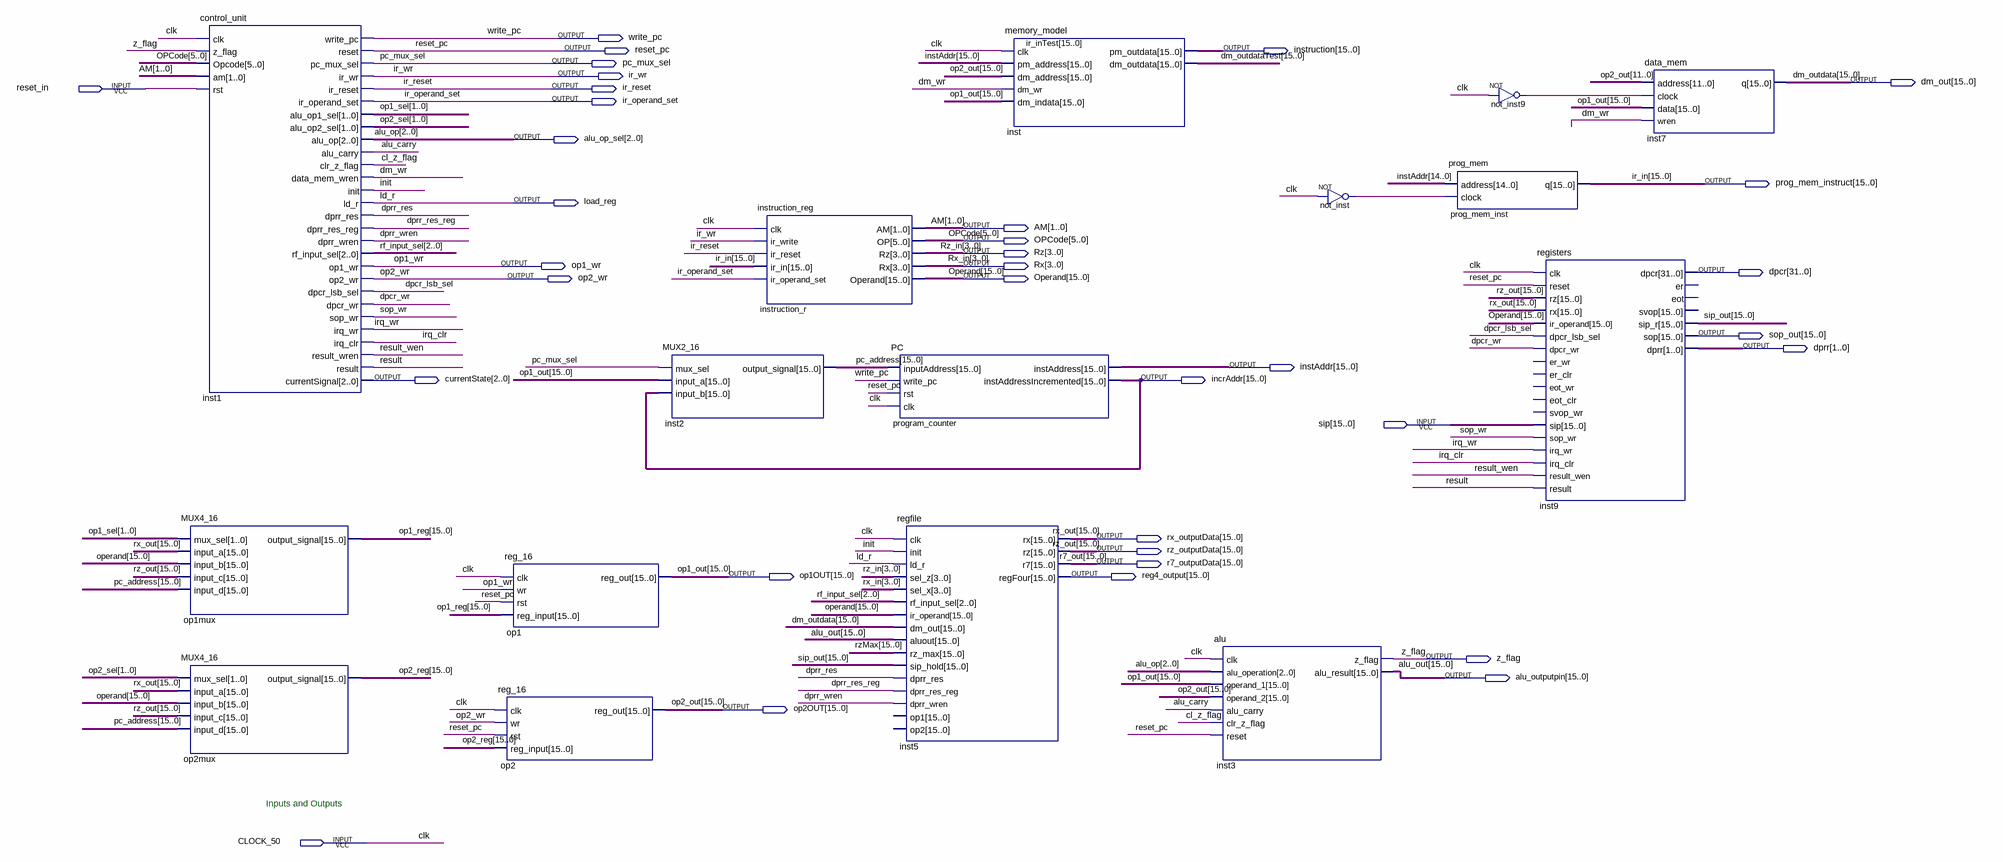
[diagram p0: schematic sheet]
// Quartus schematic pc_test.bdf as structural Verilog: 16 symbols, 35 pins
module pc_test (
  input  reset_in,
  input  [15:0] sip,
  input  CLOCK_50,
  output write_pc,
  output reset_pc,
  output [15:0] instruction,
  output pc_mux_sel,
  output ir_wr,
  output [15:0] dm_out,
  output ir_reset,
  output ir_operand_set,
  output [2:0] alu_op_sel,
  output [15:0] prog_mem_instruct,
  output load_reg,
  output [1:0] AM,
  output [5:0] OPCode,
  output [3:0] Rz,
  output op1_wr,
  output [3:0] Rx,
  output [31:0] dpcr,
  output op2_wr,
  output [15:0] Operand,
  output [15:0] sop_out,
  output [1:0] dprr,
  output [15:0] instAddr,
  output [2:0] currentState,
  output [15:0] incrAddr,
  output [15:0] rx_outputData,
  output [15:0] rz_outputData,
  output [15:0] r7_outputData,
  output [15:0] op1OUT,
  output [15:0] reg4_output,
  output z_flag,
  output [15:0] alu_outputpin,
  output [15:0] op2OUT
);

  wire alu_carry, cl_z_flag, dm_wr, dpcr_lsb_sel, dpcr_wr, dprr_res, dprr_res_reg, dprr_wren, init, irq_clr,
       irq_wr, not_inst9_out, not_inst_out, result, result_wen, sop_wr;
  wire [1:0] op1_sel, op2_sel;
  wire [2:0] rf_input_sel;
  wire [15:0] dm_outdataTest, op1_reg, op2_reg, pc_address, rzMax, sip_out;

  MUX4_16 op1mux (
    .mux_sel(op1_sel), .input_a(rx_outputData), .input_b(Operand), .input_c(rz_outputData),
    .input_d(pc_address), .output_signal(op1_reg));
  MUX4_16 op2mux (
    .mux_sel(op2_sel), .input_a(rx_outputData), .input_b(Operand), .input_c(rz_outputData),
    .input_d(pc_address), .output_signal(op2_reg));
  control_unit inst1 (
    .clk(CLOCK_50), .z_flag(z_flag), .Opcode(OPCode), .am(AM), .rst(reset_in), .write_pc(write_pc),
    .reset(reset_pc), .pc_mux_sel(pc_mux_sel), .ir_wr(ir_wr), .ir_reset(ir_reset),
    .ir_operand_set(ir_operand_set), .alu_op1_sel(op1_sel), .alu_op2_sel(op2_sel), .alu_op(alu_op_sel),
    .alu_carry(alu_carry), .clr_z_flag(cl_z_flag), .data_mem_wren(dm_wr), .init(init), .ld_r(load_reg),
    .dprr_res(dprr_res), .dprr_res_reg(dprr_res_reg), .dprr_wren(dprr_wren), .rf_input_sel(rf_input_sel),
    .op1_wr(op1_wr), .op2_wr(op2_wr), .dpcr_lsb_sel(dpcr_lsb_sel), .dpcr_wr(dpcr_wr), .sop_wr(sop_wr),
    .irq_wr(irq_wr), .irq_clr(irq_clr), .result_wren(result_wen), .result(result),
    .currentSignal(currentState));
  reg_16 op1 (.clk(CLOCK_50), .wr(op1_wr), .rst(reset_pc), .reg_input(op1_reg), .reg_out(op1OUT));
  reg_16 op2 (.clk(CLOCK_50), .wr(op2_wr), .rst(reset_pc), .reg_input(op2_reg), .reg_out(op2OUT));
  MUX2_16 inst2 (.mux_sel(pc_mux_sel), .input_a(op1OUT), .input_b(incrAddr), .output_signal(pc_address));
  instruction_reg instruction_r (
    .clk(CLOCK_50), .ir_write(ir_wr), .ir_reset(ir_reset), .ir_in(prog_mem_instruct),
    .ir_operand_set(ir_operand_set), .AM(AM), .OP(OPCode), .Rz(Rz), .Rx(Rx), .Operand(Operand));
  PC program_counter (
    .inputAddress(pc_address), .write_pc(write_pc), .rst(reset_pc), .clk(CLOCK_50), .instAddress(instAddr),
    .instAddressIncremented(incrAddr));
  regfile inst5 (
    .clk(CLOCK_50), .init(init), .ld_r(load_reg), .sel_z(Rz), .sel_x(Rx), .rf_input_sel(rf_input_sel),
    .ir_operand(Operand), .dm_out(dm_out), .aluout(alu_outputpin), .rz_max(rzMax), .sip_hold(sip_out),
    .dprr_res(dprr_res), .dprr_res_reg(dprr_res_reg), .dprr_wren(dprr_wren), .rx(rx_outputData),
    .rz(rz_outputData), .r7(r7_outputData), .regFour(reg4_output));  // open: op1, op2
  memory_model inst (
    .clk(CLOCK_50), .pm_address(instAddr), .dm_address(op2OUT), .dm_wr(dm_wr), .dm_indata(op1OUT),
    .pm_outdata(instruction), .dm_outdata(dm_outdataTest));
  alu inst3 (
    .clk(CLOCK_50), .alu_operation(alu_op_sel), .operand_1(op1OUT), .operand_2(op2OUT),
    .alu_carry(alu_carry), .clr_z_flag(cl_z_flag), .reset(reset_pc), .z_flag(z_flag),
    .alu_result(alu_outputpin));
  not not_inst (not_inst_out, CLOCK_50);
  prog_mem prog_mem_inst (.address(instAddr[14:0]), .clock(not_inst_out), .q(prog_mem_instruct));
  not not_inst9 (not_inst9_out, CLOCK_50);
  registers inst9 (
    .clk(CLOCK_50), .reset(reset_pc), .rz(rz_outputData), .rx(rx_outputData), .ir_operand(Operand),
    .dpcr_lsb_sel(dpcr_lsb_sel), .dpcr_wr(dpcr_wr), .sip(sip), .sop_wr(sop_wr), .irq_wr(irq_wr),
    .irq_clr(irq_clr), .result_wen(result_wen), .result(result), .dpcr(dpcr), .sip_r(sip_out), .sop(sop_out),
    .dprr(dprr));  // open: er_wr, er_clr, eot_wr, eot_clr, svop_wr, er, eot, svop
  data_mem inst7 (.address(op2OUT[11:0]), .clock(not_inst9_out), .data(op1OUT), .wren(dm_wr), .q(dm_out));

  // Other names for the same wires on the sheet: alu_op[2:0] = alu_op_sel; alu_out[15:0] = alu_outputpin;
  //   clk = CLOCK_50; dm_outdata[15:0] = dm_out; ir_in[15:0] = prog_mem_instruct; ir_inTest[15:0] = instruction;
  //   ld_r = load_reg; op1_out[15:0] = op1OUT; op2_out[15:0] = op2OUT; r7_out[15:0] = r7_outputData; Rx_in[3:0] = Rx;
  //   rx_out[15:0] = rx_outputData; Rz_in[3:0] = Rz; rz_out[15:0] = rz_outputData

  // Notes on the sheet:
  //   Inputs and Outputs
endmodule
